# EAGLE design Box_Light_NEW (EAGLE 9.5.2)
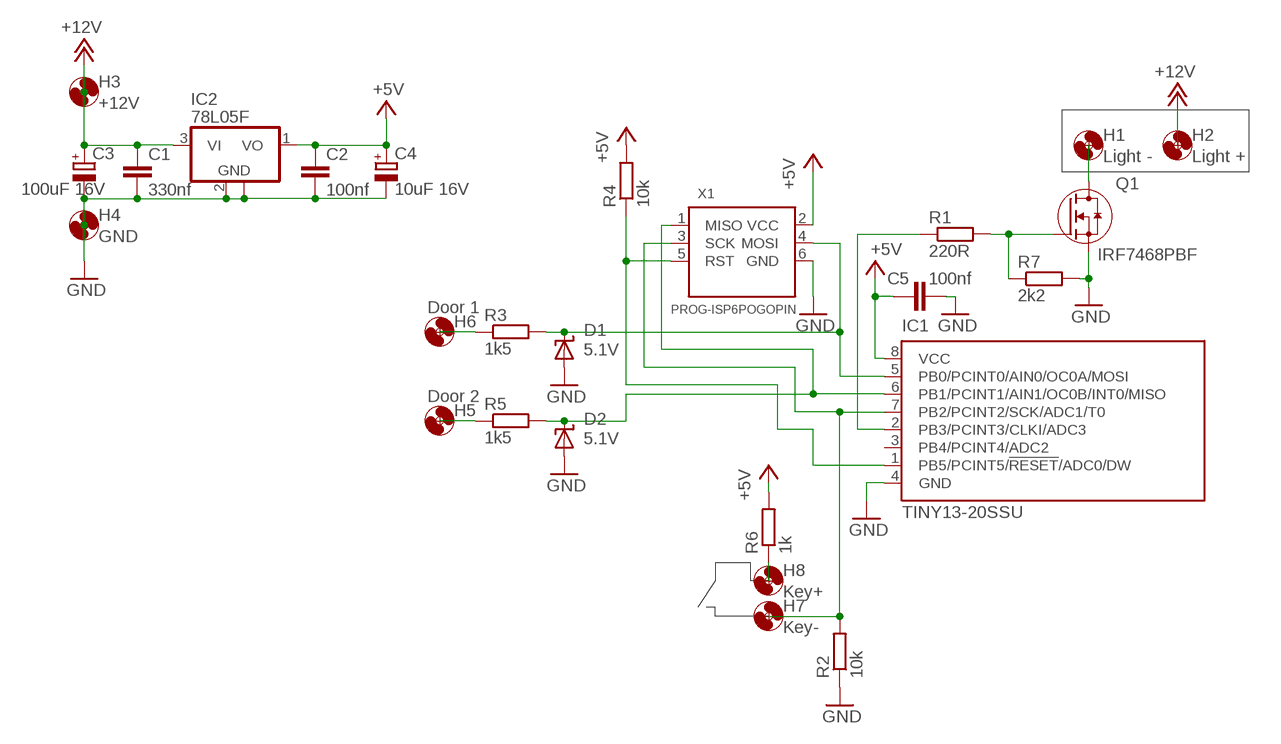
[diagram p0: schematic, sheet 1]

## Parts
C1  330nf  C-EUC0805  [C0805]
C2  100nf  C-EUC0805  [C0805]
C3  100uF 16V  CPOL-EUSMCC  [SMC_C]
C4  10uF 16V  CPOL-EUSMCB  [SMC_B]
C5  100nf  C-EUC0805  [C0805]
D1  5.1V  ZENER  [SOD123]
D2  5.1V  ZENER  [SOD123]
H1  Light -  MOUNT-HOLE3.0  [3,0]
H2  Light +  MOUNT-HOLE3.0  [3,0]
H3  +12V  MOUNT-HOLE3.0  [3,0]
H4  GND  MOUNT-HOLE3.0  [3,0]
H5  Door 2  MOUNT-HOLE2.8  [2,8]
H6  Door 1  MOUNT-HOLE2.8  [2,8]
H7  Key-  MOUNT-HOLE2.8  [2,8]
H8  Key+  MOUNT-HOLE2.8  [2,8]
IC1  TINY13-20SSU  [8S1]
IC2  78L05F  [SOT89]
Q1  IRF7468PBF  [SO08]
R1  220R  R-EU_R0805  [R0805]
R2  10k  R-EU_R0805  [R0805]
R3  1k5  R-EU_R0805  [R0805]
R4  10k  R-EU_R0805  [R0805]
R5  1k5  R-EU_R0805  [R0805]
R6  1k  R-EU_R0805  [R0805]
R7  2k2  R-EU_R0805  [R0805]
X1  PROG-ISP6POGOPIN  [PROG_POGOPIN]

## Nets
+5V: C2.1 C4.+ C5.1 IC1.8(VCC) IC2.1(VO) R4.2 R6.2 X1.2(VCC)
+12V: C1.1 C3.+ H2.P$1 H3.P$1 IC2.3(VI)
GND: C1.2 C2.2 C3.- C4.- C5.2 D1.A D2.A H4.P$1 IC1.4(GND) IC2.2(GND) IC2.2@1(GND) Q1.1(S) Q1.2(S) Q1.3(S) R2.1 R7.2 X1.6(GND)
N$1: Q1.4(G) R1.2 R7.1
N$2: H1.P$1 Q1.5(D) Q1.6(D) Q1.7(D) Q1.8(D)
N$3: H7.P$1 IC1.7(PB2/PCINT2/SCK/ADC1/T0) R2.2 X1.3(SCK)
N$4: H5.P$1 R5.1
N$5: D1.C IC1.5(PB0/PCINT0/AIN0/OC0A/MOSI) R3.2 X1.4(MOSI)
N$6: IC1.2(PB3/PCINT3/CLKI/ADC3) R1.1
N$7: IC1.1(PB5/PCINT5/!RESET!/ADC0/DW) R4.1 X1.5(RST)
N$8: D2.C IC1.6(PB1/PCINT1/AIN1/OC0B/INT0/MISO) R5.2 X1.1(MISO)
N$9: H8.P$1 R6.1
N$10: H6.P$1 R3.1
Unconnected: IC1.3(PB4/PCINT4/ADC2)

## Library data of the parts
C1 C2 C5 = rcl:C-EU: CAPACITOR, European symbol
C3 C4 = rcl:CPOL-EU: POLARIZED CAPACITOR, European symbol; SPICEPREFIX: C
D1 D2 = usb:ZENER
H1-H8 = holes:MOUNT-HOLE: MOUNTING HOLE with drill center marker
IC1 = atmel:TINY13: 8-bit AVR Microcontroller with 1K Bytes In-System Programmable Flash Source: http://www.atmel.com/dyn/resources/prod_documents/2535S.pdf; MPN: ATTINY13-20SSU; OC_FARNELL: 1455133; OC_NEWARK: 58M3771
IC2 = linear:78L*: POSITOIV-VOLTAGE REGULATORS Output up to 100 mA Source: Datasheet <http://focus.ti.com/lit/ds/symlink/ua78l05.pdf>
Q1 = usb:IRF7468PBF
R1-R7 = rcl:R-EU_: RESISTOR, European symbol; SPICEPREFIX: R
X1 = usb:PROG-ISP

## Board
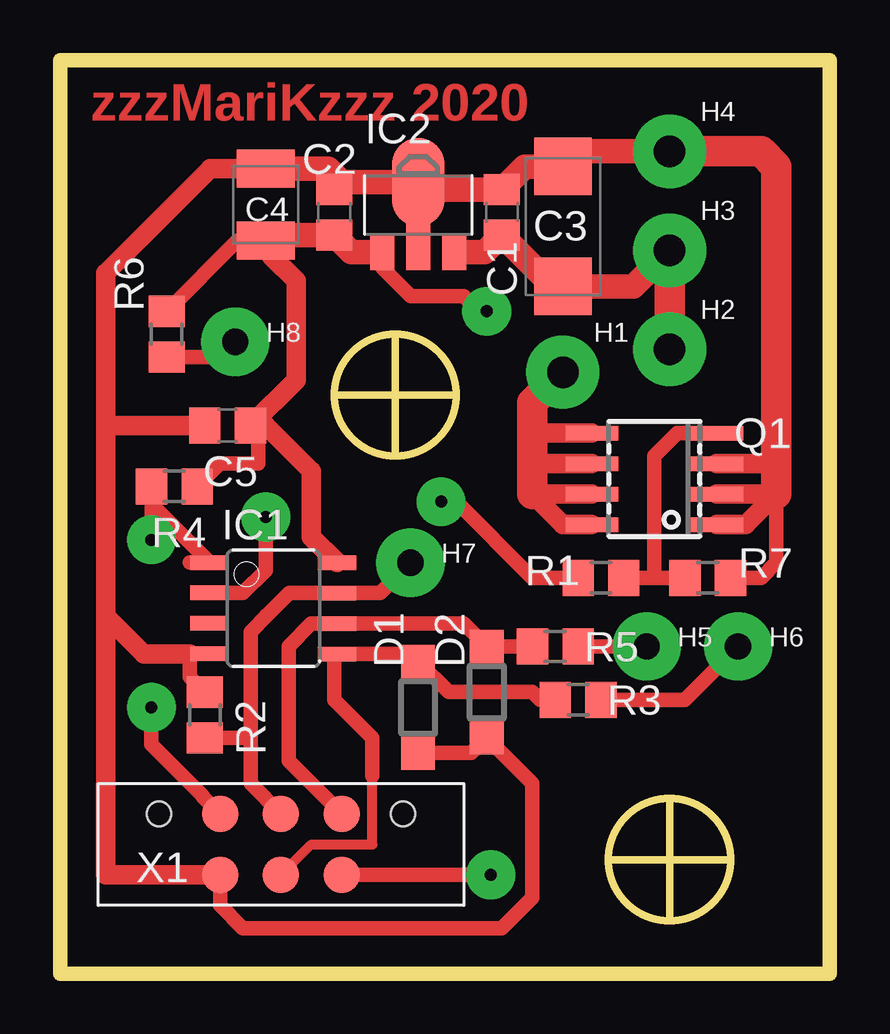
[diagram p1: board, top side]
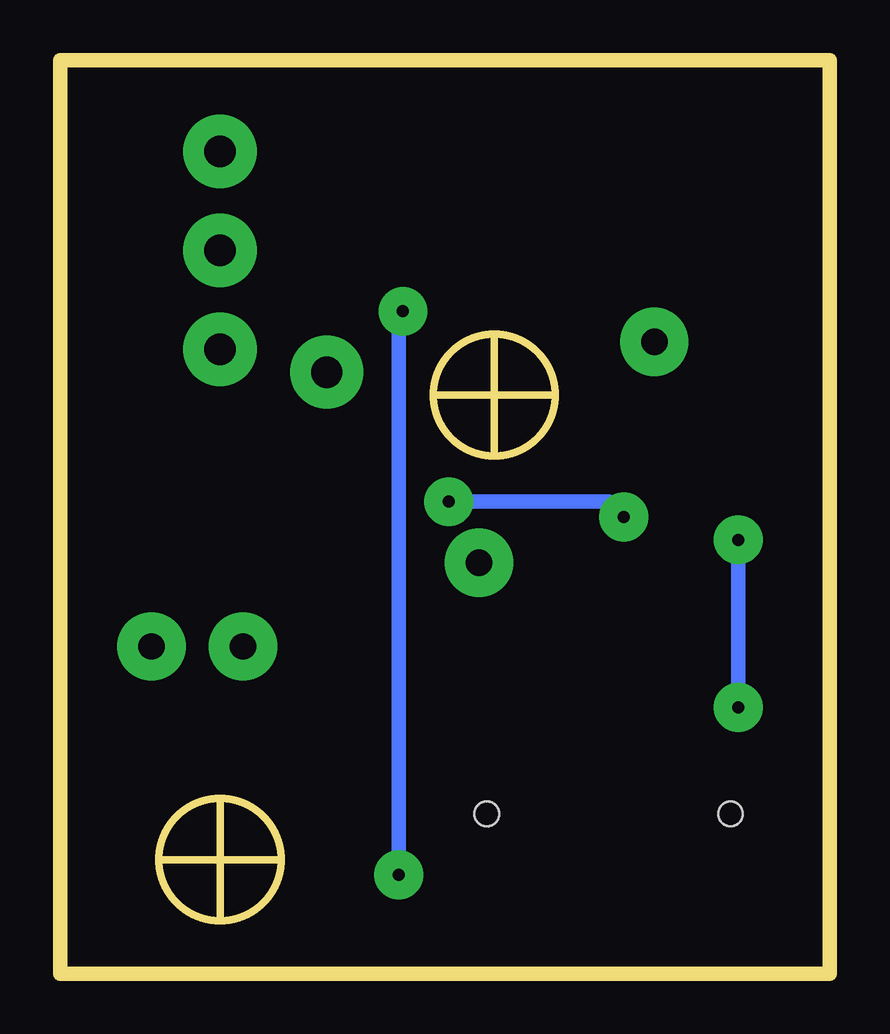
[diagram p2: board, bottom side, seen from below]

Size 32.07 x 38.1 mm. Coordinates in mm from the lower left corner, seen from the top.
Outline: 13.97,26.67 13.97,21.59
Outline: 11.43,24.13 16.51,24.13
Outline: 25.4,4.76 25.4,7.3
Outline: 27.94,4.76 25.4,4.76
Outline: 22.86,4.76 25.4,4.76
Outline: 25.4,4.76 25.4,2.22
Outline: 0,38.1 32.07,38.1 32.07,0 0,0 0,38.1
Outline: circle at 13.97,24.13 radius 2.54
Outline: circle at 25.4,4.76 radius 2.54
Copper layers (1*16): Top 0.035mm / dielectric 1.5mm / Bottom 0.035mm
Design rules "default": minimum track width 12mil, minimum drill 32mil, track to track 12mil, track to pad 12mil, pad to pad 12mil, via to via 12mil, smd to smd 8mil, copper to edge 40mil, drill to drill 8mil, minimum pad ring 16mil, minimum via ring 12mil, stop-mask expansion 4mil, vias tented up to drill 0mil, thermal gap 20mil

### Footprints (pad centres in the part's own frame; a part is rotated, then mirrored left to right if it is on the bottom)
C0805 = smd 1.3 x 1.5: 1 -0.95,0; 2 0.95,0
SMC_C = smd 2.4 x 2.4: + -2.5,0; - 2.5,0
SMC_B = smd 1.6 x 2.4: + -1.5,0; - 1.5,0
SOD123 = smd 1.4 x 1.4: A 1.9,0; C -1.9,0
3,0 = drill 1.3 pad 3.048: P$1 0,0
2,8 = drill 1.1 pad 2.845: P$1 0,0
8S1 = smd 0.6 x 1.6: 1 -1.905,-2.654; 2 -0.645,-2.654; 3 0.625,-2.654; 4 1.895,-2.654; 5 1.905,2.654; 6 0.635,2.654; 7 -0.635,2.654; 8 -1.905,2.654
SOT89 = smd 1 x 1.5: 1 -1.499,-1.981; 3 1.499,-1.981 | smd 1 x 2: 2 0,-1.727 | smd 2.2 x 3.7: 2@1 0,0.94
SO08 = smd 0.6 x 2.2: 1 -1.905,-2.6; 2 -0.635,-2.6; 3 0.635,-2.6; 4 1.905,-2.6; 5 1.905,2.6; 6 0.635,2.6; 7 -0.635,2.6; 8 -1.905,2.6
R0805 = smd 1.3 x 1.5: 1 -0.95,0; 2 0.95,0
PROG_POGOPIN = smd 1.524 x 1.524: 1 0,7.62; 2 2.54,7.62; 3 0,5.08; 4 2.54,5.08; 5 0,2.54; 6 2.54,2.54 | hole 1.016: 0,0; 0,10.16

### Placement (x,y rotation side)
C1  18.41,31.75 90 top
C2  11.43,31.75 90 top
C3  20.95,31.15 90 top
C4  8.57,32.07 90 top
C5  6.99,22.86 180 top
D1  14.92,11.11 270 top
D2  17.78,11.75 270 top
H1  20.95,25.08 0 top
H2  25.4,26.04 0 top
H3  25.4,30.16 0 top
H4  25.4,34.29 0 top
H5  24.45,13.65 0 top
H6  28.26,13.65 0 top
H7  14.61,17.14 0 top
H8  7.3,26.35 0 top
IC1  8.89,15.24 270 top
IC2  14.92,32.07 0 top
Q1  24.77,20.64 90 top
R1  22.54,16.51 0 top
R2  6.03,10.79 270 top
R3  21.59,11.43 180 top
R4  4.76,20.32 0 top
R5  20.64,13.65 180 top
R6  4.45,26.67 90 top
R7  26.99,16.51 0 top
X1  4.13,6.67 270 top

### Tracks (layer width: path | path; a pad name or v marks a point on that pad's centre or on a via)
+5V  (via drill 0.5 pad 2.03)
  Top 0.61: X1.2 v17.95,4.13 | 9.84,24.77 | 8.81,29.93 8.81,30.8 | R6.2 7.39,30.57 C4.+ | 8.57,22.86 C5.1 8.26,22.54 8.26,21.27 6.67,21.27 R4.2 | v17.78,27.62 17.46,27.62 16.83,28.26 14.6,28.26 13.42,29.44 IC2.1
  Top 0.813: C5.1 9.84,24.77 | 9.84,24.77 9.84,28.89 8.81,29.93 | IC1.8 10.48,18.21 10.48,20.95 8.57,22.86
  Top 1.016: IC2.1 12.14,30.09 C2.1 8.81,30.8 C4.+
  Bottom 0.61: v17.95,4.13 17.95,27.45 v17.78,27.62
+12V
  Top 1.016: IC2.3 17.7,30.09 C1.1 20.56,28.65 C3.+ 23.89,28.65 H3.P$1
  Top 1.27: H2.P$1 H3.P$1
GND
  Top 0.61: IC1.4 6.23,13.34 5.4,13.34 5.4,12.38 R2.1 | R7.2 29.21,16.51 29.84,17.15 29.84,20 | IC2.2 IC2.2@1 | 2.22,22.86 1.9,23.18 | D1.A 17.15,9.21 D2.A 19.68,7.94 19.68,3.17 18.42,1.9 7.62,1.9 6.67,2.86 X1.6
  Top 0.813: Q1.1 28.58,18.73 29.84,20 Q1.2 | Q1.3 29.84,21.27 | C4.- 6.26,33.57 1.9,29.21 1.9,23.18 1.9,14.92 | 1.9,14.92 3.49,13.34 5.4,13.34 | C5.2 2.22,22.86 | X1.6 1.9,4.13 1.9,14.92
  Top 1.016: H4.P$1 21.59,34.29 C3.- 19.37,33.65 C1.2 15.23,32.7 IC2.2@1 11.74,33.01 | 11.74,33.01 C2.2 | C4.- 11.18,33.57 11.74,33.01
  Top 1.27: H4.P$1 29.21,34.29 29.84,33.65 29.84,21.27 29.84,20
N$1
  Top 0.61: Q1.4 25.72,22.54 24.77,21.59 24.77,16.51 | 24.77,16.51 R7.1 | 24.77,16.51 R1.2
N$2
  Top 0.813: Q1.8 20.95,18.73 19.68,20 Q1.7 | Q1.6 19.68,21.27 | Q1.5 19.68,22.54
  Top 1.27: H1.P$1 19.68,23.81 19.68,22.54 19.68,21.27 19.68,20
N$3
  Top 0.61: 8.57,14.92 8.62,14.97 8.64,14.97 | 8.64,14.97 9.55,15.87 IC1.7 13.34,15.87 H7.P$1 | X1.3 7.94,7.94 7.94,9.84 | 8.64,14.97 7.94,14.26 7.94,9.84 | R2.2 7.93,9.84 7.94,9.84
N$4
  Top 0.61: 21.49,13.87 R5.1 H5.P$1
N$5
  Top 0.406: X1.4 10.48,5.4 13.02,5.4 13.02,8.26
  Top 0.61: 13.02,8.26 13.02,9.84 11.43,11.43 11.43,13.22 IC1.5 14.29,13.34 14.61,13.01 D1.C 16.19,11.75 19.68,11.75 20,11.43 R3.2
N$6  (via drill 0.5 pad 2.03)
  Top 0.406: 21.69,16.19 R1.1
  Top 0.61: v15.87,19.68 16.51,19.68 19.68,16.51 R1.1 | IC1.2 7.61,15.89 7.62,15.87 8.57,16.83 v8.57,19.05
  Bottom 0.61: v8.57,19.05 9.21,19.68 v15.87,19.68
N$7  (via drill 0.5 pad 2.03)
  Top 0.61: 5.4,17.15 IC1.1 3.81,19.57 R4.1 v3.81,18.1 | X1.5 5.96,7.38 5.96,7.43 3.81,9.57 v3.81,11.11
  Bottom 0.61: v3.81,18.1 v3.81,11.11
N$8
  Top 0.61: D2.C | X1.1 9.52,8.89 9.52,13.65 10.48,14.6 IC1.6 16.82,14.6 D2.C | R5.2 D2.C
N$9
  Top 0.61: R6.1 6.67,25.72 H8.P$1
N$10
  Top 0.61: R3.1 26.04,11.43 H6.P$1

### Text on the board
Top: zzzMariKzzz 2020